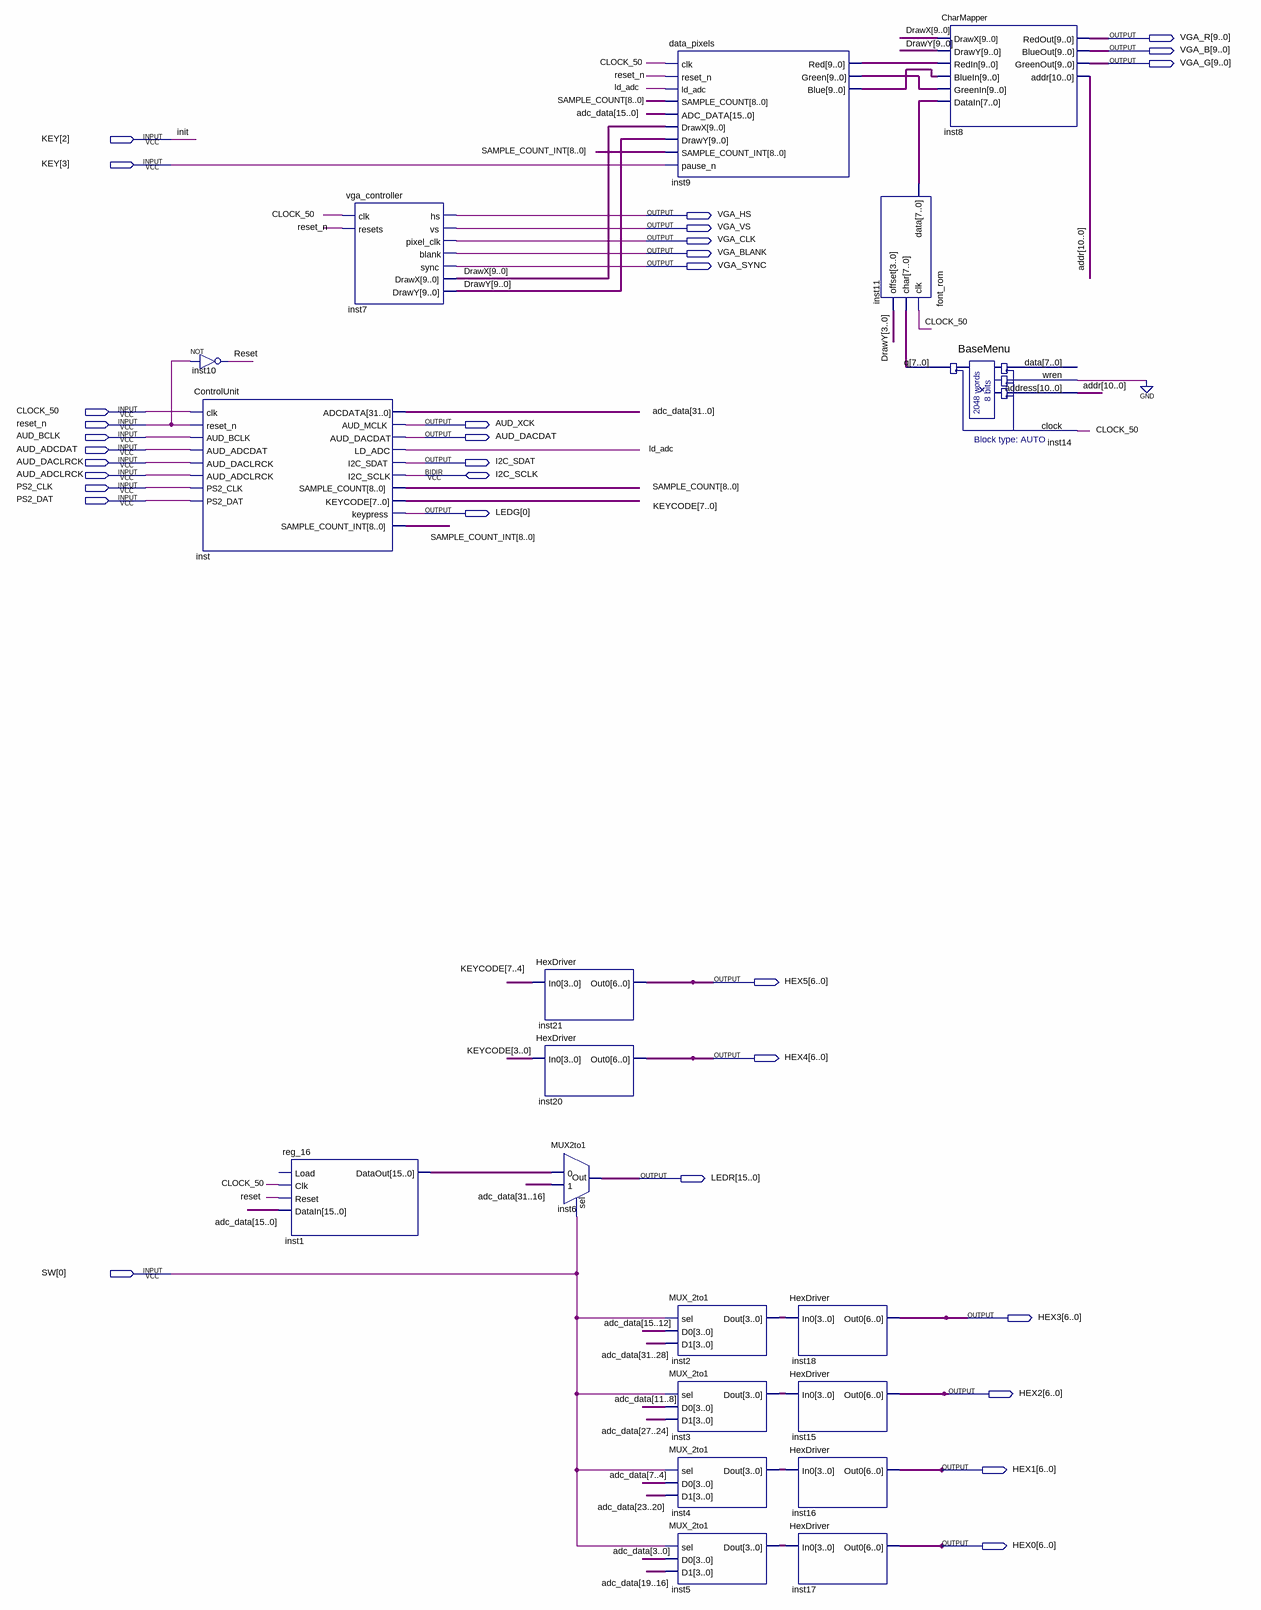
[diagram p0: schematic sheet]
// Quartus schematic OScope.bdf as structural Verilog: 19 symbols, 31 pins
module OScope (
  input  [3:2] KEY,
  input  CLOCK_50,
  input  reset_n,
  input  AUD_BCLK,
  input  AUD_ADCDAT,
  input  AUD_DACLRCK,
  input  AUD_ADCLRCK,
  input  PS2_CLK,
  input  PS2_DAT,
  input  [0:0] SW,
  inout  I2C_SCLK,
  output [9:0] VGA_R,
  output [9:0] VGA_B,
  output [9:0] VGA_G,
  output VGA_HS,
  output VGA_VS,
  output VGA_CLK,
  output VGA_BLANK,
  output VGA_SYNC,
  output AUD_XCK,
  output AUD_DACDAT,
  output I2C_SDAT,
  output [0:0] LEDG,
  output [6:0] HEX5,
  output [6:0] HEX4,
  output [15:0] LEDR,
  output [6:0] HEX3,
  output [6:0] HEX2,
  output [6:0] HEX1,
  output [6:0] HEX0
);

  wire ld_adc, reset;
  wire [3:0] inst2_dout, inst3_dout, inst4_dout, inst5_dout;
  wire [7:0] inst11_data, inst14_q, KEYCODE;
  wire [8:0] SAMPLE_COUNT, SAMPLE_COUNT_INT;
  wire [9:0] DrawX, DrawY, inst9_blue, inst9_green, inst9_red;
  wire [10:0] addr;
  wire [15:0] inst1_dataout;
  wire [31:0] adc_data;

  not inst10 (reset, reset_n);
  ControlUnit inst (
    .clk(CLOCK_50), .reset_n(reset_n), .AUD_BCLK(AUD_BCLK), .AUD_ADCDAT(AUD_ADCDAT),
    .AUD_DACLRCK(AUD_DACLRCK), .AUD_ADCLRCK(AUD_ADCLRCK), .PS2_CLK(PS2_CLK), .PS2_DAT(PS2_DAT),
    .ADCDATA(adc_data), .AUD_MCLK(AUD_XCK), .AUD_DACDAT(AUD_DACDAT), .LD_ADC(ld_adc), .I2C_SDAT(I2C_SDAT),
    .I2C_SCLK(I2C_SCLK), .SAMPLE_COUNT(SAMPLE_COUNT), .KEYCODE(KEYCODE), .keypress(LEDG[0]),
    .SAMPLE_COUNT_INT(SAMPLE_COUNT_INT));
  reg_16 inst1 (.Clk(CLOCK_50), .Reset(reset), .DataIn(adc_data[15:0]), .DataOut(inst1_dataout));  // open: Load
  vga_controller inst7 (
    .clk(CLOCK_50), .resets(reset_n), .hs(VGA_HS), .vs(VGA_VS), .pixel_clk(VGA_CLK), .blank(VGA_BLANK),
    .sync(VGA_SYNC), .DrawX(DrawX), .DrawY(DrawY));
  HexDriver inst21 (.In0(KEYCODE[7:4]), .Out0(HEX5));
  HexDriver inst20 (.In0(KEYCODE[3:0]), .Out0(HEX4));
  MUX2to1 inst6 (.sel(SW[0]), .D0(inst1_dataout), .D1(adc_data[31:16]), .Dout(LEDR));
  data_pixels inst9 (
    .clk(CLOCK_50), .reset_n(reset_n), .ld_adc(ld_adc), .SAMPLE_COUNT(SAMPLE_COUNT),
    .ADC_DATA(adc_data[15:0]), .DrawX(DrawX), .DrawY(DrawY), .SAMPLE_COUNT_INT(SAMPLE_COUNT_INT),
    .pause_n(KEY[3]), .Red(inst9_red), .Green(inst9_green), .Blue(inst9_blue));
  MUX_2to1 inst2 (.sel(SW[0]), .D0(adc_data[15:12]), .D1(adc_data[31:28]), .Dout(inst2_dout));
  MUX_2to1 inst3 (.sel(SW[0]), .D0(adc_data[11:8]), .D1(adc_data[27:24]), .Dout(inst3_dout));
  MUX_2to1 inst4 (.sel(SW[0]), .D0(adc_data[7:4]), .D1(adc_data[23:20]), .Dout(inst4_dout));
  MUX_2to1 inst5 (.sel(SW[0]), .D0(adc_data[3:0]), .D1(adc_data[19:16]), .Dout(inst5_dout));
  HexDriver inst18 (.In0(inst2_dout), .Out0(HEX3));
  HexDriver inst15 (.In0(inst3_dout), .Out0(HEX2));
  HexDriver inst16 (.In0(inst4_dout), .Out0(HEX1));
  HexDriver inst17 (.In0(inst5_dout), .Out0(HEX0));
  font_rom inst11 (.clk(CLOCK_50), .char(inst14_q), .offset(DrawY[3:0]), .data(inst11_data));
  CharMapper inst8 (
    .DrawX(DrawX), .DrawY(DrawY), .RedIn(inst9_red), .BlueIn(inst9_blue), .GreenIn(inst9_green),
    .DataIn(inst11_data), .RedOut(VGA_R), .BlueOut(VGA_B), .GreenOut(VGA_G), .addr(addr));
  BaseMenu inst14 (.wren(1'b0), .address(addr), .clock(CLOCK_50), .q(inst14_q));  // open: data

  // Other names for the same wires on the sheet: init = KEY[2]
endmodule
